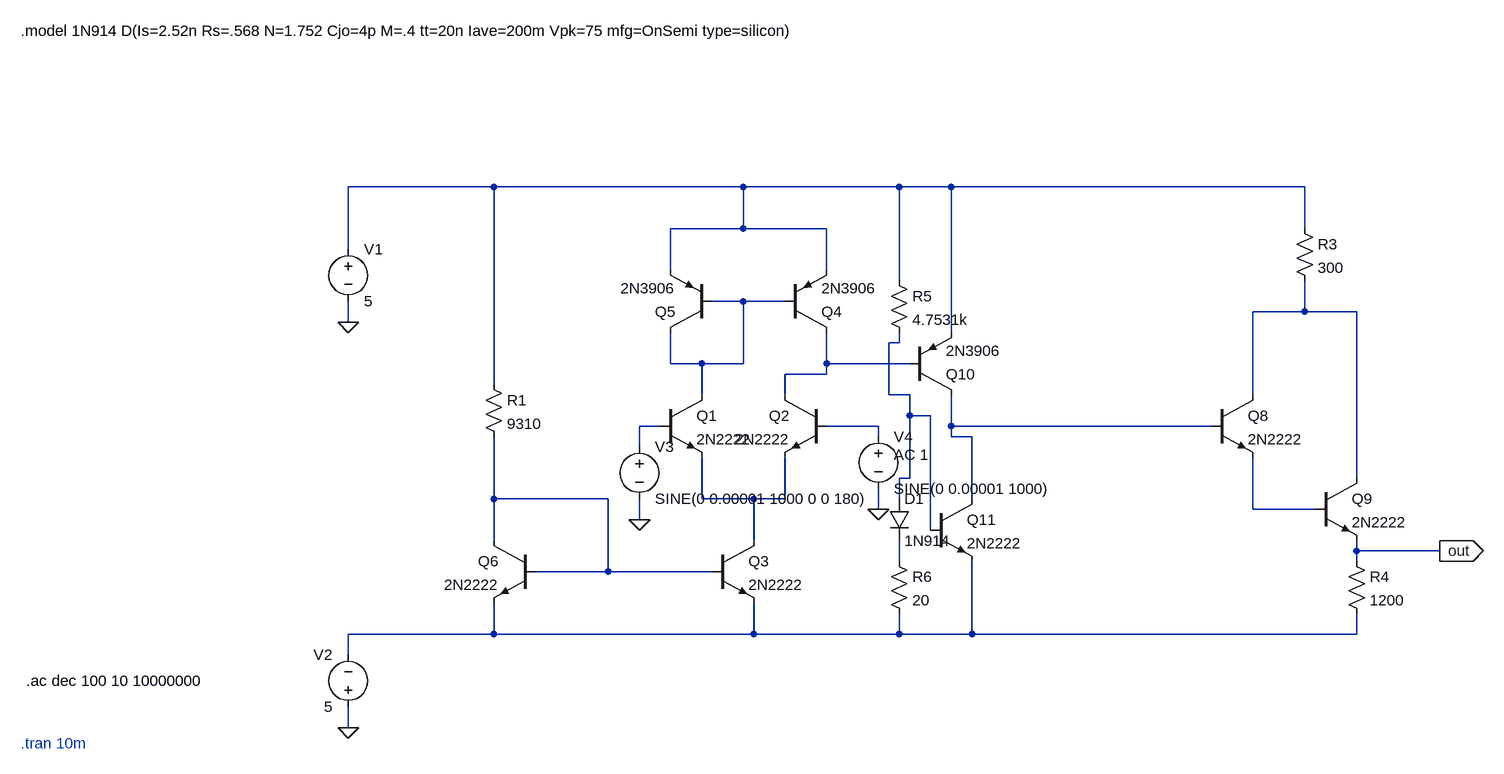
[diagram p0: schematic Final Power Operational Amplifier_1.asc]
Final Power Operational Amplifier_1.asc, the LTspice schematic file:
Version 4
SHEET 1 1420 680
WIRE -256 -448 -480 -448
WIRE 128 -448 -256 -448
WIRE 368 -448 128 -448
WIRE 448 -448 368 -448
WIRE 992 -448 448 -448
WIRE 128 -384 128 -448
WIRE 128 -384 16 -384
WIRE 256 -384 128 -384
WIRE 992 -384 992 -448
WIRE -480 -352 -480 -448
WIRE 16 -320 16 -384
WIRE 256 -320 256 -384
WIRE 368 -304 368 -448
WIRE 128 -272 80 -272
WIRE 192 -272 128 -272
WIRE 992 -256 992 -304
WIRE 992 -256 912 -256
WIRE 1072 -256 992 -256
WIRE -480 -240 -480 -272
WIRE 448 -224 448 -448
WIRE 368 -208 368 -224
WIRE 368 -208 352 -208
WIRE 16 -176 16 -224
WIRE 64 -176 16 -176
WIRE 128 -176 128 -272
WIRE 128 -176 64 -176
WIRE 256 -176 256 -224
WIRE 384 -176 256 -176
WIRE 256 -160 256 -176
WIRE 256 -160 192 -160
WIRE -256 -144 -256 -448
WIRE 64 -128 64 -176
WIRE 192 -128 192 -160
WIRE 352 -128 352 -208
WIRE 384 -128 352 -128
WIRE 912 -128 912 -256
WIRE 384 -96 384 -128
WIRE 416 -96 384 -96
WIRE 0 -80 -32 -80
WIRE 336 -80 256 -80
WIRE 448 -80 448 -128
WIRE 848 -80 448 -80
WIRE 336 -64 336 -80
WIRE 448 -64 448 -80
WIRE 480 -64 448 -64
WIRE -32 -48 -32 -80
WIRE 384 0 384 -96
WIRE 384 0 368 0
WIRE 1072 0 1072 -256
WIRE -256 32 -256 -64
WIRE -80 32 -256 32
WIRE 64 32 64 -32
WIRE 144 32 64 32
WIRE 192 32 192 -32
WIRE 192 32 144 32
WIRE 368 32 368 0
WIRE 480 32 480 -64
WIRE 336 48 336 16
WIRE 912 48 912 -32
WIRE 1008 48 912 48
WIRE -32 64 -32 32
WIRE 416 80 416 -96
WIRE -256 96 -256 32
WIRE 144 96 144 32
WIRE 1072 112 1072 96
WIRE 1200 112 1072 112
WIRE 368 128 368 96
WIRE 1072 128 1072 112
WIRE -80 144 -80 32
WIRE -80 144 -192 144
WIRE 80 144 -80 144
WIRE -256 240 -256 192
WIRE -256 240 -480 240
WIRE 144 240 144 192
WIRE 144 240 -256 240
WIRE 368 240 368 208
WIRE 368 240 144 240
WIRE 480 240 480 128
WIRE 480 240 368 240
WIRE 1072 240 1072 208
WIRE 1072 240 480 240
WIRE -480 272 -480 240
WIRE -480 384 -480 352
FLAG -480 -240 0
FLAG -480 384 0
FLAG 336 48 0
FLAG -32 64 0
FLAG 1200 112 out
IOPIN 1200 112 Out
SYMBOL npn 0 -128 R0
SYMATTR InstName Q1
SYMATTR Value 2N2222
SYMBOL npn 256 -128 M0
SYMATTR InstName Q2
SYMATTR Value 2N2222
SYMBOL npn 80 96 R0
SYMATTR InstName Q3
SYMATTR Value 2N2222
SYMBOL pnp 192 -224 M180
SYMATTR InstName Q4
SYMATTR Value 2N3906
SYMBOL pnp 80 -224 R180
SYMATTR InstName Q5
SYMATTR Value 2N3906
SYMBOL npn -192 96 M0
SYMATTR InstName Q6
SYMATTR Value 2N2222
SYMBOL res -272 -160 R0
SYMATTR InstName R1
SYMATTR Value 9310
SYMBOL voltage -480 -368 R0
WINDOW 123 0 0 Left 0
WINDOW 39 0 0 Left 0
SYMATTR InstName V1
SYMATTR Value 5
SYMBOL voltage -480 368 R180
WINDOW 0 24 96 Left 2
WINDOW 3 24 16 Left 2
WINDOW 123 0 0 Left 0
WINDOW 39 0 0 Left 0
SYMATTR InstName V2
SYMATTR Value 5
SYMBOL voltage 336 -80 R0
WINDOW 123 24 44 Left 2
WINDOW 39 0 0 Left 0
SYMATTR Value2 AC 1
SYMATTR InstName V4
SYMATTR Value SINE(0 0.00001 1000)
SYMBOL voltage -32 -64 R0
WINDOW 123 0 0 Left 0
WINDOW 39 0 0 Left 0
SYMATTR InstName V3
SYMATTR Value SINE(0 0.00001 1000 0 0 180)
SYMBOL npn 848 -128 R0
SYMATTR InstName Q8
SYMATTR Value 2N2222
SYMBOL npn 1008 0 R0
SYMATTR InstName Q9
SYMATTR Value 2N2222
SYMBOL res 976 -400 R0
SYMATTR InstName R3
SYMATTR Value 300
SYMBOL res 1056 112 R0
SYMATTR InstName R4
SYMATTR Value 1200
SYMBOL pnp 384 -128 M180
SYMATTR InstName Q10
SYMATTR Value 2N3906
SYMBOL npn 416 32 R0
SYMATTR InstName Q11
SYMATTR Value 2N2222
SYMBOL res 352 -320 R0
SYMATTR InstName R5
SYMATTR Value 4.7531k
SYMBOL res 352 112 R0
SYMATTR InstName R6
SYMATTR Value 20
SYMBOL diode 352 32 R0
SYMATTR InstName D1
SYMATTR Value 1N914
TEXT -984 -688 Left 2 !.model 1N914 D(Is=2.52n Rs=.568 N=1.752 Cjo=4p M=.4 tt=20n Iave=200m Vpk=75 mfg=OnSemi type=silicon)
TEXT -984 408 Left 2 ;.tran 10m
TEXT -976 312 Left 2 !.ac dec 100 10 10000000

The netlist it stands for:
* Final Power Operational Amplifier_1.asc
Q1 N002 N006 N010 0 2N2222
Q2 N005 N007 N010 0 2N2222
Q3 N010 N009 N013 0 2N2222
Q4 N005 N002 N001 0 2N3906
Q5 N002 N002 N001 0 2N3906
Q6 N009 N009 N013 0 2N2222
R1 N001 N009 9310
V1 N001 0 5
V2 0 N013 5
V4 N007 0 SINE(0 0.00001 1000) AC 1
V3 N006 0 SINE(0 0.00001 1000 0 0 180)
Q8 N003 N008 N011 0 2N2222
Q9 N003 N011 out 0 2N2222
R3 N001 N003 300
R4 out N013 1200
Q10 N008 N005 N001 0 2N3906
Q11 N008 N004 N013 0 2N2222
R5 N001 N004 4.7531k
R6 N012 N013 20
D1 N004 N012 1N914
.model D D
.lib standard.dio
.model NPN NPN
.model PNP PNP
.lib standard.bjt
.model 1N914 D(Is=2.52n Rs=.568 N=1.752 Cjo=4p M=.4 tt=20n Iave=200m Vpk=75 mfg=OnSemi type=silicon)
* .tran 10m
.ac dec 100 10 10000000
.backanno
.end